# Altium schematic sheet 04_MCU_ESP32.SchDoc
size A3; SheetNumber: 4; SheetTotal: 9
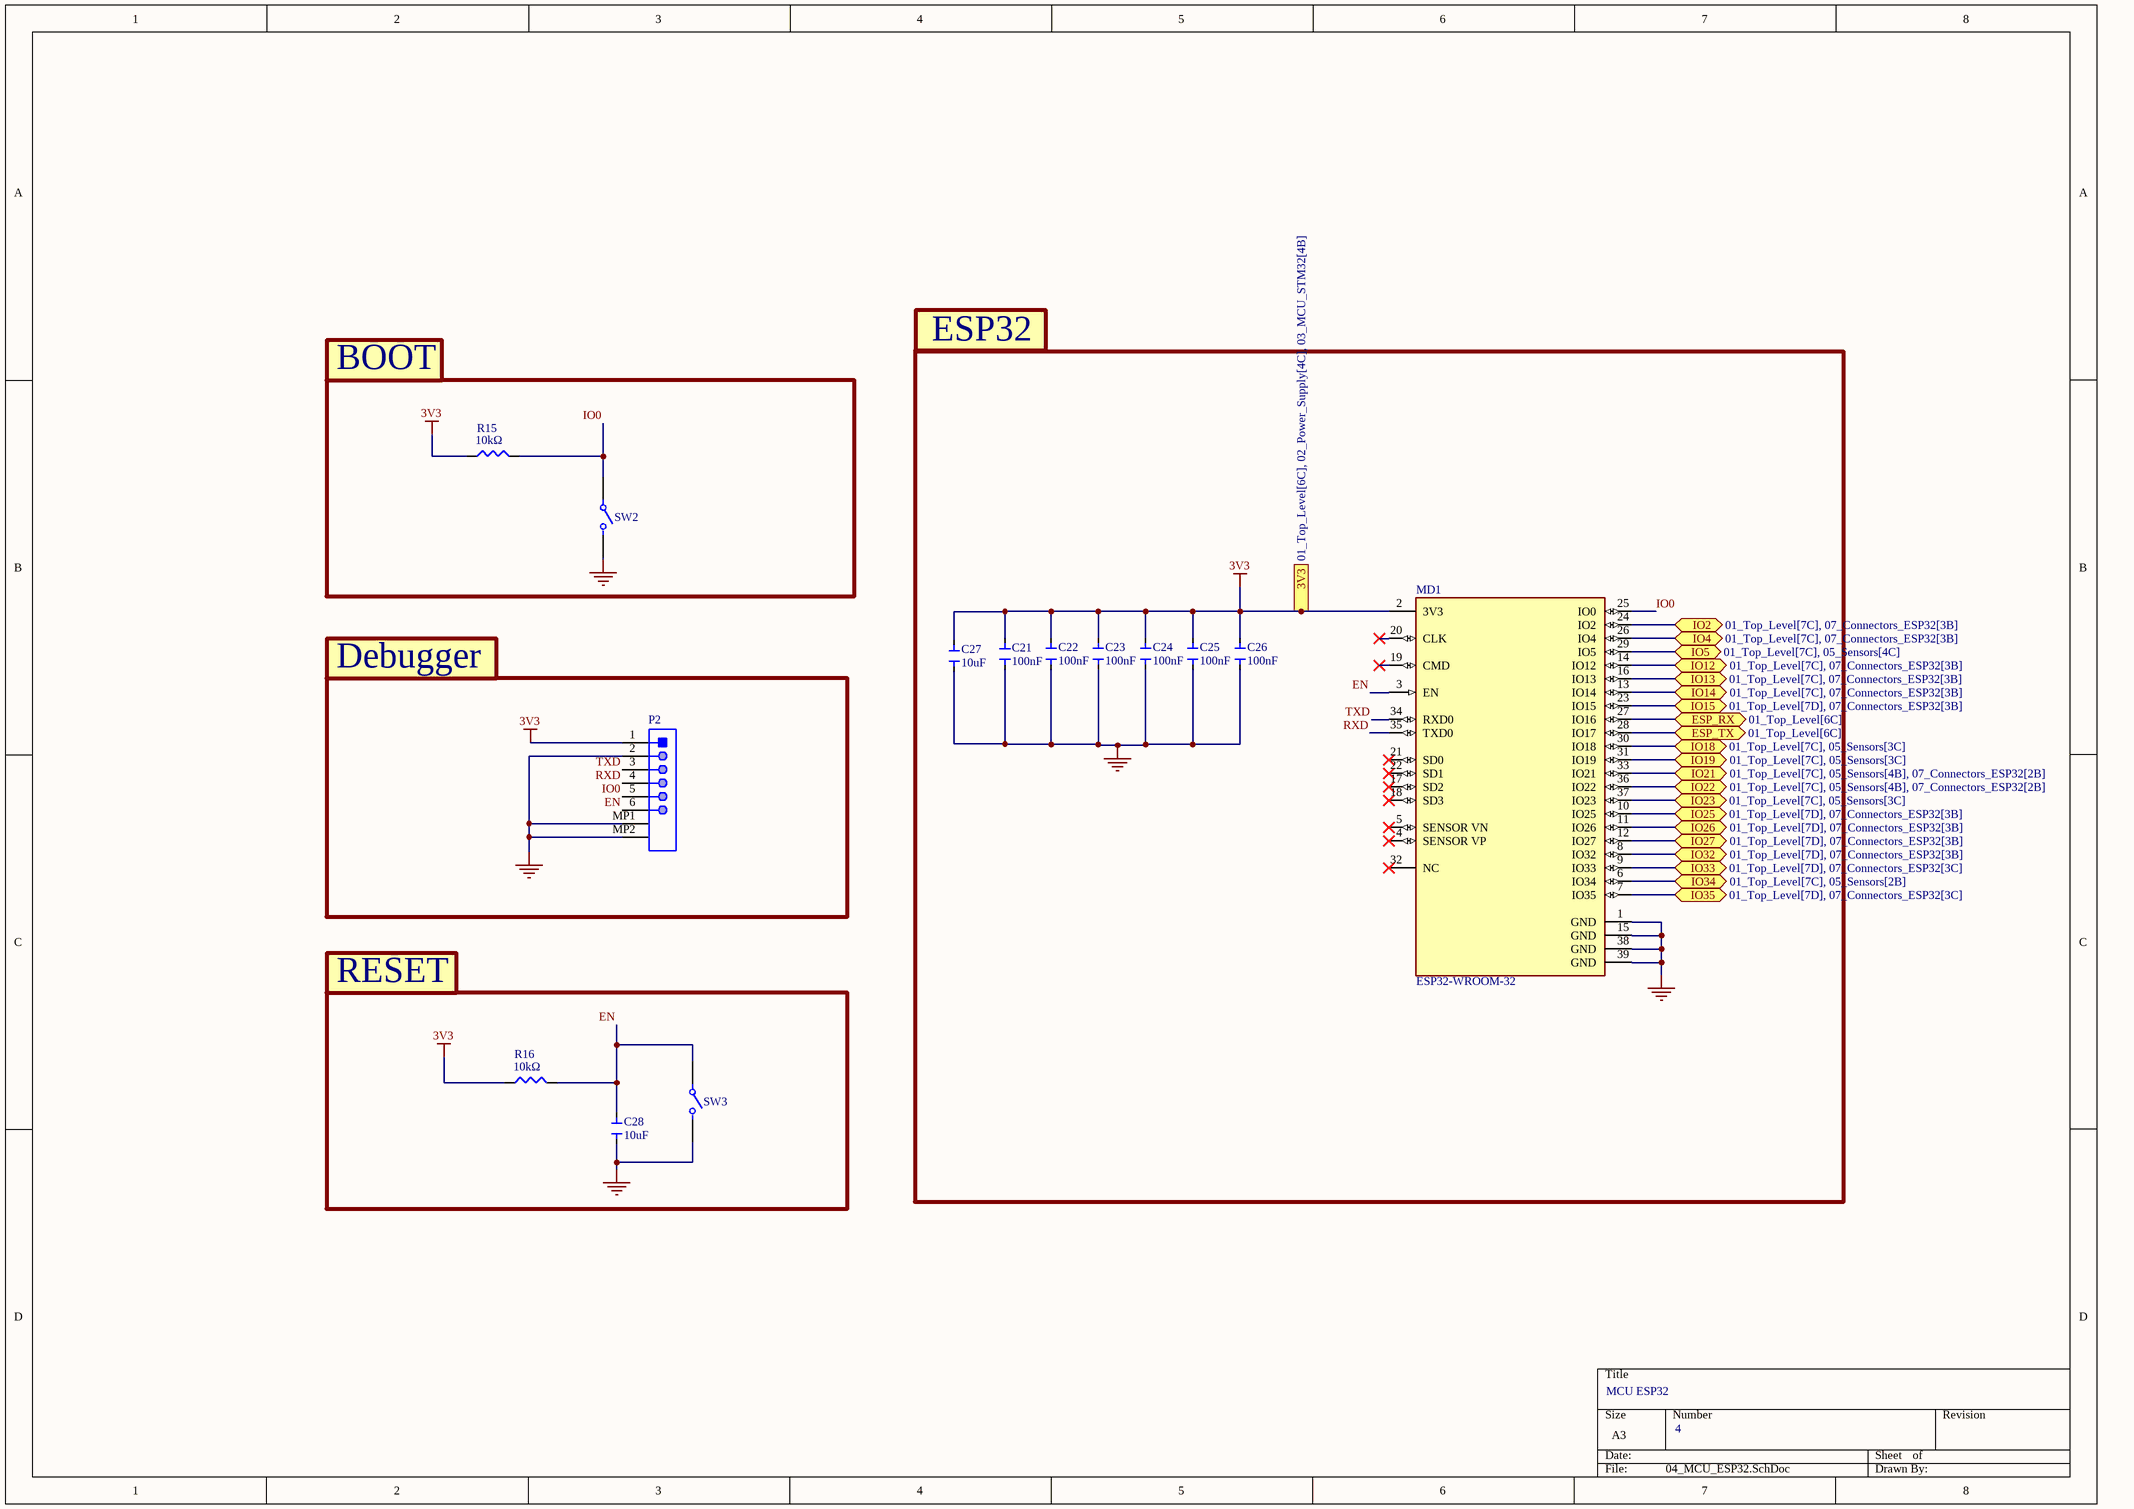
[diagram p0: 04_MCU_ESP32.SchDoc]

## Parts
C21  100nF  [CAP_100nF]
C22  100nF  [CAP_100nF]
C23  100nF  [CAP_100nF]
C24  100nF  [CAP_100nF]
C25  100nF  [CAP_100nF]
C26  100nF  [CAP_100nF]
C27  10uF  [CAP_10uF]
C28  10uF  [CAP_10uF]
MD1  ESP32-WROOM-32  [FP-ESP32-WROOM-32-MFG]
P2  SM06B-SRSS-TB(LF)(SN)  [JST-SM06B-SRSS-TB_V]  (value not drawn)
R15  10kΩ  [RES_10K]
R16  10kΩ  [RES_10K]
SW2  EVP-BD6C1A000  [FP-EVP-BD6C1A000-MFG]  (value not drawn)
SW3  EVP-BD6C1A000  [FP-EVP-BD6C1A000-MFG]  (value not drawn)

## Blocks framed on the sheet
BOOT: R15 SW2
ESP32: C21-C27 MD1
Debugger: P2
RESET: C28 R16 SW3

## Ports
3V3 (see 01_Top_Level[6C], 02_Power_Supply[4C], 03_MCU_STM32[4B]), ESP_RX (bidir, see 01_Top_Level[6C]), ESP_TX (bidir, see 01_Top_Level[6C]), IO2 (bidir, see 01_Top_Level[7C], 07_Connectors_ESP32[3B]), IO4 (bidir, see 01_Top_Level[7C], 07_Connectors_ESP32[3B]), IO5 (bidir, see 01_Top_Level[7C], 05_Sensors[4C]), IO12 (bidir, see 01_Top_Level[7C], 07_Connectors_ESP32[3B]), IO13 (bidir, see 01_Top_Level[7C], 07_Connectors_ESP32[3B]), IO14 (bidir, see 01_Top_Level[7C], 07_Connectors_ESP32[3B]), IO15 (bidir, see 01_Top_Level[7D], 07_Connectors_ESP32[3B]), IO18 (bidir, see 01_Top_Level[7C], 05_Sensors[3C]), IO19 (bidir, see 01_Top_Level[7C], 05_Sensors[3C]), IO21 (bidir, see 01_Top_Level[7C], 05_Sensors[4B], 07_Connectors_ESP32[2B]), IO22 (bidir, see 01_Top_Level[7C], 05_Sensors[4B], 07_Connectors_ESP32[2B]), IO23 (bidir, see 01_Top_Level[7C], 05_Sensors[3C]), IO25 (bidir, see 01_Top_Level[7D], 07_Connectors_ESP32[3B]), IO26 (bidir, see 01_Top_Level[7D], 07_Connectors_ESP32[3B]), IO27 (bidir, see 01_Top_Level[7D], 07_Connectors_ESP32[3B]), IO32 (bidir, see 01_Top_Level[7D], 07_Connectors_ESP32[3B]), IO33 (bidir, see 01_Top_Level[7D], 07_Connectors_ESP32[3C]), IO34 (bidir, see 01_Top_Level[7C], 05_Sensors[2B]), IO35 (bidir, see 01_Top_Level[7D], 07_Connectors_ESP32[3C])

## Nets
3V3: C21.2 C22.2 C23.2 C24.2 C25.2 C26.2 C27.2 MD1.2(3V3) P2.1 R15.1 R16.1 ; port 3V3
GND: C21.1 C22.1 C23.1 C24.1 C25.1 C26.1 C27.1 C28.2 MD1.1(GND) MD1.15(GND) MD1.38(GND) MD1.39(GND) P2.2 P2.MP1 P2.MP2 SW2.B SW3.B
EN: C28.1 MD1.3(EN) P2.6 R16.2 SW3.A
ESP_RX: MD1.27(IO16) ; port ESP_RX
ESP_TX: MD1.28(IO17) ; port ESP_TX
IO0: MD1.25(IO0) P2.5 R15.2 SW2.A
IO2: MD1.24(IO2) ; port IO2
IO4: MD1.26(IO4) ; port IO4
IO5: MD1.29(IO5) ; port IO5
IO12: MD1.14(IO12) ; port IO12
IO13: MD1.16(IO13) ; port IO13
IO14: MD1.13(IO14) ; port IO14
IO15: MD1.23(IO15) ; port IO15
IO18: MD1.30(IO18) ; port IO18
IO19: MD1.31(IO19) ; port IO19
IO21: MD1.33(IO21) ; port IO21
IO22: MD1.36(IO22) ; port IO22
IO23: MD1.37(IO23) ; port IO23
IO25: MD1.10(IO25) ; port IO25
IO26: MD1.11(IO26) ; port IO26
IO27: MD1.12(IO27) ; port IO27
IO32: MD1.8(IO32) ; port IO32
IO33: MD1.9(IO33) ; port IO33
IO34: MD1.6(IO34) ; port IO34
IO35: MD1.7(IO35) ; port IO35
RXD: MD1.35(TXD0) P2.4
TXD: MD1.34(RXD0) P2.3

Not connected (* = marked no-connect by the designer): MD1 4(SENSOR_VP)* 5(SENSOR_VN)* 17(SD2)* 18(SD3)* 19(CMD)* 20(CLK)* 21(SD0)* 22(SD1)* 32(NC)*

## Notes on the sheet
- MCU ESP32
- 4

## Library data of the parts
C21-C26 = CAP_100nF: CAP 100nF 50V X7R ±10% 0603 Ceramic Capacitors RoHS; manufacturer: YAGEO; manufacturer part number: CC0603KRX7R9BB104; value: 100nf; supplier: LCSC; supplier part number: C14663; ComponentLink1Description: Datasheet; ComponentLink1URL: https://www.lcsc.com/datasheet/C14663.pdf
C27 C28 = CAP_0402_10UF: CAP CER 10UF 10V X5R 0402; Manufacturer: Samsung Electro-Mechanics; Manufacturer Part Number: C307415; Dielectric Material: Ceramic; Multilayer: Yes; Tolerance  (fill in as +-): 20%; Supplier: LCSC; Supplier Part Number: 1276-6830-1-ND; RoHS: Yes; Category: Ceramic Capacitors; Stock: 1294909; Pricing: 1=0.33, 10=0.215, 50=0.1584, 100=0.129, 500=0.1018, 1000=0.08597, 2500=0.08145 (USD); Mounting Technology: Surface Mount; Pins: 2; Package Shape: Rectangular; Case/Package: 0402; Terminal Finish: Nickel; Min Operating Temperature: -55°C; Max Operating Temperature: 85°C; JESD-609 Code: e3; Value: 10uF; Capacitor Type: Ceramic; Packaging: Tape and Reel; Tolerance (fill in as +-): 20%; Rated DC Voltage (URdc): 10V; Temperature Characteristics Code: X5R; Termination: Wraparound; Reach SVHC Compliant: Yes; RoHS Compliant: Yes; ComponentLink1URL: https://datasheet.ciiva.com:443/pdfs/VipMasterIC/IC/SEMS/SEMS-S-A0008521219/SEMS-S-A0008521325-1.pdf?src-supplier=IHS+Markit; ComponentLink1Description: https://datasheet.ciiva.com:443/pdfs/VipMasterIC/IC/SEMS/SEMS-S-A0008521219/SEMS-S-A0008521325-1.pdf?src-supplier=IHS+Markit; ComponentLink2URL: http://www.samsungsem.com/kr/support/product-search/mlcc/CL05A106MP8NUB8.jsp?src-supplier=Digikey; ComponentLink2Description: http://www.samsungsem.com/kr/support/product-search/mlcc/CL05A106MP8NUB8.jsp?src-supplier=Digikey; ComponentLink3URL: https://datasheet.octopart.com/CL05A106MP8NUB8-Samsung-Electro-Mechanics-datasheet-136460857.pdf?src-supplier=Future+Electronics; ComponentLink3Description: https://datasheet.octopart.com/CL05A106MP8NUB8-Samsung-Electro-Mechanics-datasheet-136460857.pdf?src-supplier=Future+Electronics; LCSC Part Number: C307415
MD1 = CMP-194065-000008-1: RX TXRX MOD WIFI SURFACE MOUNT; Frequency: 2.5GHz; Sensitivity: -98dBm; Operating Supply Voltage: 3.6V; Data Rate: 150Mbps; Weight: 0.088185oz; Package Quantity: 550; Min Operating Temperature: -40°C; Mount: Surface Mount; Max Operating Temperature: 85°C; Packaging: Cut Tape; Case/Package: SMD/SMT
P2 = CMP-2000-07080-1: Male Header, Pitch 1 mm, 1 x 6 Position, Height 2.95 mm, -25 to 85 degC, RoHS, Tape and Reel; Manufacturer: JST; No of Positions: 6; Pitch: 1mm; Style/Orientation: RightAngleHeader/Plug; Datasheet URL: https://datasheet.ciiva.com/26894/getdatasheetpartid-708885-26894671.pdf; Package Description: Male Header, Pitch 1 mm, 1 X 6 Position, Height 2.9 mm; Termination: Solder; Manufacturer URL: http://www.jst.com/home2.html; Type: ShroudedHeader; Package Reference: SM06B-SRSS-TB; Datasheet Version: 11/2010; Mounting Technology: SurfaceMount
R15 R16 = RES_0603_10K: 100mW Thin Film Resistor ±0.1% ±10ppm/℃ 10kΩ 0603 Chip Resistor - Surface Mount ROHS; Manufacturer: Yageo Group; Manufacturer Part Number: RT0603BRB07169KL; Manufacturer: YAGEO; Temperature Coefficient: 10ppm/°C; Voltage Rating: 75V; Features: Moisture Resistant; Height: 450µm; Length: 1.6002mm; Lifecycle Status: Production; Max Operating Temperature: 155°C; Max Power Dissipation: 100mW; Min Operating Temperature: -55°C; Mounting Technology: Surface Mount; Number of Terminals: 2; Number of Terminations: 2; Packaging: Tape & Reel; Power Dissipation: 100mW; Power Rating: 100mW; REACH SVHC: Yes; Tolerance: 0.1%; Width: 800µm; Working Voltage: 75V; ComponentLink1URL: https://datasheet.octopart.com:443/RT0603BRB07169KL-Yageo-datasheet-176402239.pdf?src-supplier=IHS; ComponentLink1Description: https://datasheet.octopart.com:443/RT0603BRB07169KL-Yageo-datasheet-176402239.pdf?src-supplier=IHS; ComponentLink2URL: https://datasheet.octopart.com:443/RT0603BRB07169KL-Yageo-datasheet-96443642.pdf?src-supplier=Upverter; ComponentLink2Description: https://datasheet.octopart.com:443/RT0603BRB07169KL-Yageo-datasheet-96443642.pdf?src-supplier=Upverter; ComponentLink3URL: https://datasheet.octopart.com:443/RT0603BRB07169KL-Yageo-Group-datasheet-141265893.pdf?src-supplier=ODG+(Origin+Data+Global); ComponentLink3Description: https://datasheet.octopart.com:443/RT0603BRB07169KL-Yageo-Group-datasheet-141265893.pdf?src-supplier=ODG+(Origin+Data+Global); ComponentLink4URL: https://datasheet.octopart.com/RT0603BRB07169KL-Yageo-datasheet-86813807.pdf; ComponentLink4Description: https://datasheet.octopart.com/RT0603BRB07169KL-Yageo-datasheet-86813807.pdf; ComponentLink5URL: http://sigma.octopart.com:80/conflict_mineral_statement/Yageo-company-3.pdf?src-supplier=Compliance+Statements; ComponentLink5Description: http://sigma.octopart.com:80/conflict_mineral_statement/Yageo-company-3.pdf?src-supplier=Compliance+Statements; ComponentLink6URL: http://sigma.octopart.com:80/rohs_statement/Yageo-company-2.pdf?src-supplier=Compliance+Statements; ComponentLink6Description: http://sigma.octopart.com:80/rohs_statement/Yageo-company-2.pdf?src-supplier=Compliance+Statements; Supplier: LCSC; Supplier Part Number: C860143; Datasheet Link: https://www.lcsc.com/datasheet/C860143.pdf
SW2 SW3 = CMP-00287-74573419-1: EVP-BD6C1A000 Switch Tactile N.O. SPST Round Button J-Bend 0.05A 12VDC 3.5N SMD Automotive T/R; Contact Current Rating: 20mA; Life (Cycles): 100kcycles; Contact Resistance: 500mΩ; Voltage Rating (DC): 15V; Number of Positions: 2; Max Operating Temperature: 90°C; NexarPartId: 74573419; RoHS: Non-Compliant; Min Operating Temperature: -40°C; Height: 4.2mm; Operating Force: 3.5N; Mount: Surface Mount